# EAGLE schematic PCB Design (EAGLE 9.5.2)
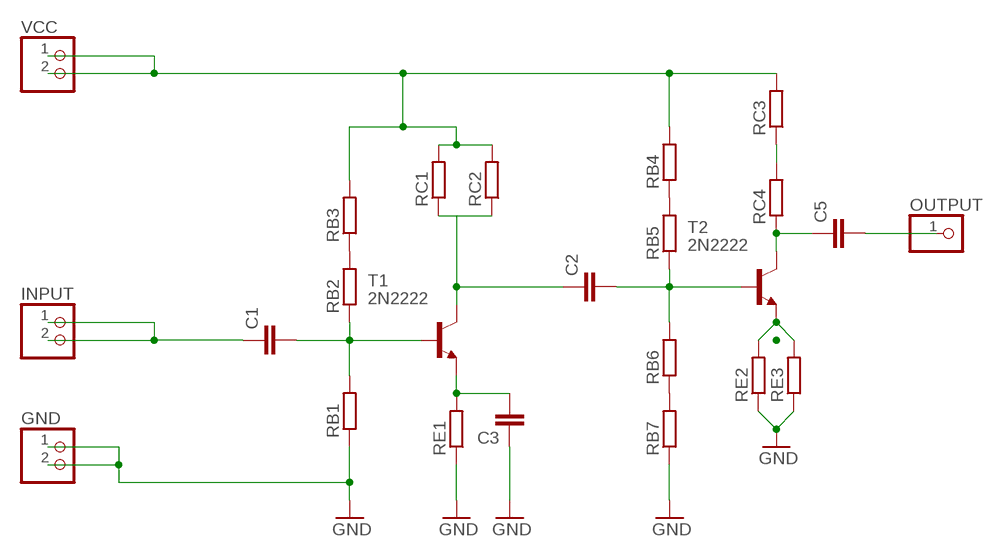
[diagram p0: schematic, sheet 1]

## Parts
C1  C-EU025-025X050  [C025-025X050]
C2  C-EU025-025X050  [C025-025X050]
C3  C-EU025-025X050  [C025-025X050]
C5  C-EU025-025X050  [C025-025X050]
GND  PINHD-1X2  [1X02]
INPUT  PINHD-1X2  [1X02]
OUTPUT  PINHD-1X1  [1X01]
RB1  R-EU_0204/7  [0204/7]
RB2  R-EU_0204/7  [0204/7]
RB3  R-EU_0204/7  [0204/7]
RB4  R-EU_0204/7  [0204/7]
RB5  R-EU_0204/7  [0204/7]
RB6  R-EU_0204/7  [0204/7]
RB7  R-EU_0204/7  [0204/7]
RC1  R-EU_0204/7  [0204/7]
RC2  R-EU_0204/7  [0204/7]
RC3  R-EU_0204/7  [0204/7]
RC4  R-EU_0204/7  [0204/7]
RE1  R-EU_0204/7  [0204/7]
RE2  R-EU_0204/7  [0204/7]
RE3  R-EU_0204/7  [0204/7]
T1  2N2222  [TO18]
T2  2N2222  [TO18]
VCC  PINHD-1X2  [1X02]

## Nets
GND: C3.1 GND.1 GND.2 RB1.1 RB7.1 RE1.1 RE2.1 RE3.1
INPUT: C1.1 INPUT.1 INPUT.2
N$1: C1.2 RB1.2 RB2.1 T1.2(B)
N$2: C3.2 RE1.2 T1.1(E)
N$3: C2.2 RB5.1 RB6.2 T2.2(B)
N$4: RB2.2 RB3.1
N$5: C2.1 RC1.1 RC2.1 T1.3(C)
N$6: RE2.2 RE3.2 T2.1(E)
N$7: RB4.1 RB5.2
N$8: RC3.1 RC4.2
N$10: RB6.1 RB7.2
N$11: C5.1 RC4.1 T2.3(C)
N$12: C5.2 OUTPUT.1
VCC: RB3.2 RB4.2 RC1.2 RC2.2 RC3.2 VCC.1 VCC.2

## Library data of the parts
C1-C3 C5 = rcl:C-EU: CAPACITOR, European symbol; SPICEPREFIX: C
GND INPUT VCC = pinhead:PINHD-1X2: PIN HEADER
OUTPUT = pinhead:PINHD-1X1: PIN HEADER
RB1-RB7 RC1-RC4 RE1-RE3 = rcl:R-EU_: RESISTOR, European symbol; SPICEPREFIX: R
T1 T2 = transistor:2N2222: NPN TRANSISTOR

## Net classes
0 default: width 0.305 mm, drill 0.508 mm, clearance 0.254 mm